# EasyEDA schematic SCH_FB-Collar-Module_2024-04-16.json
TITLE: Sheet_1; REV: 1.0; Date: 2024-04-16; Sheet: 1/1; Drawn By: fcbayernmunchenerlan999; Company: Your Company
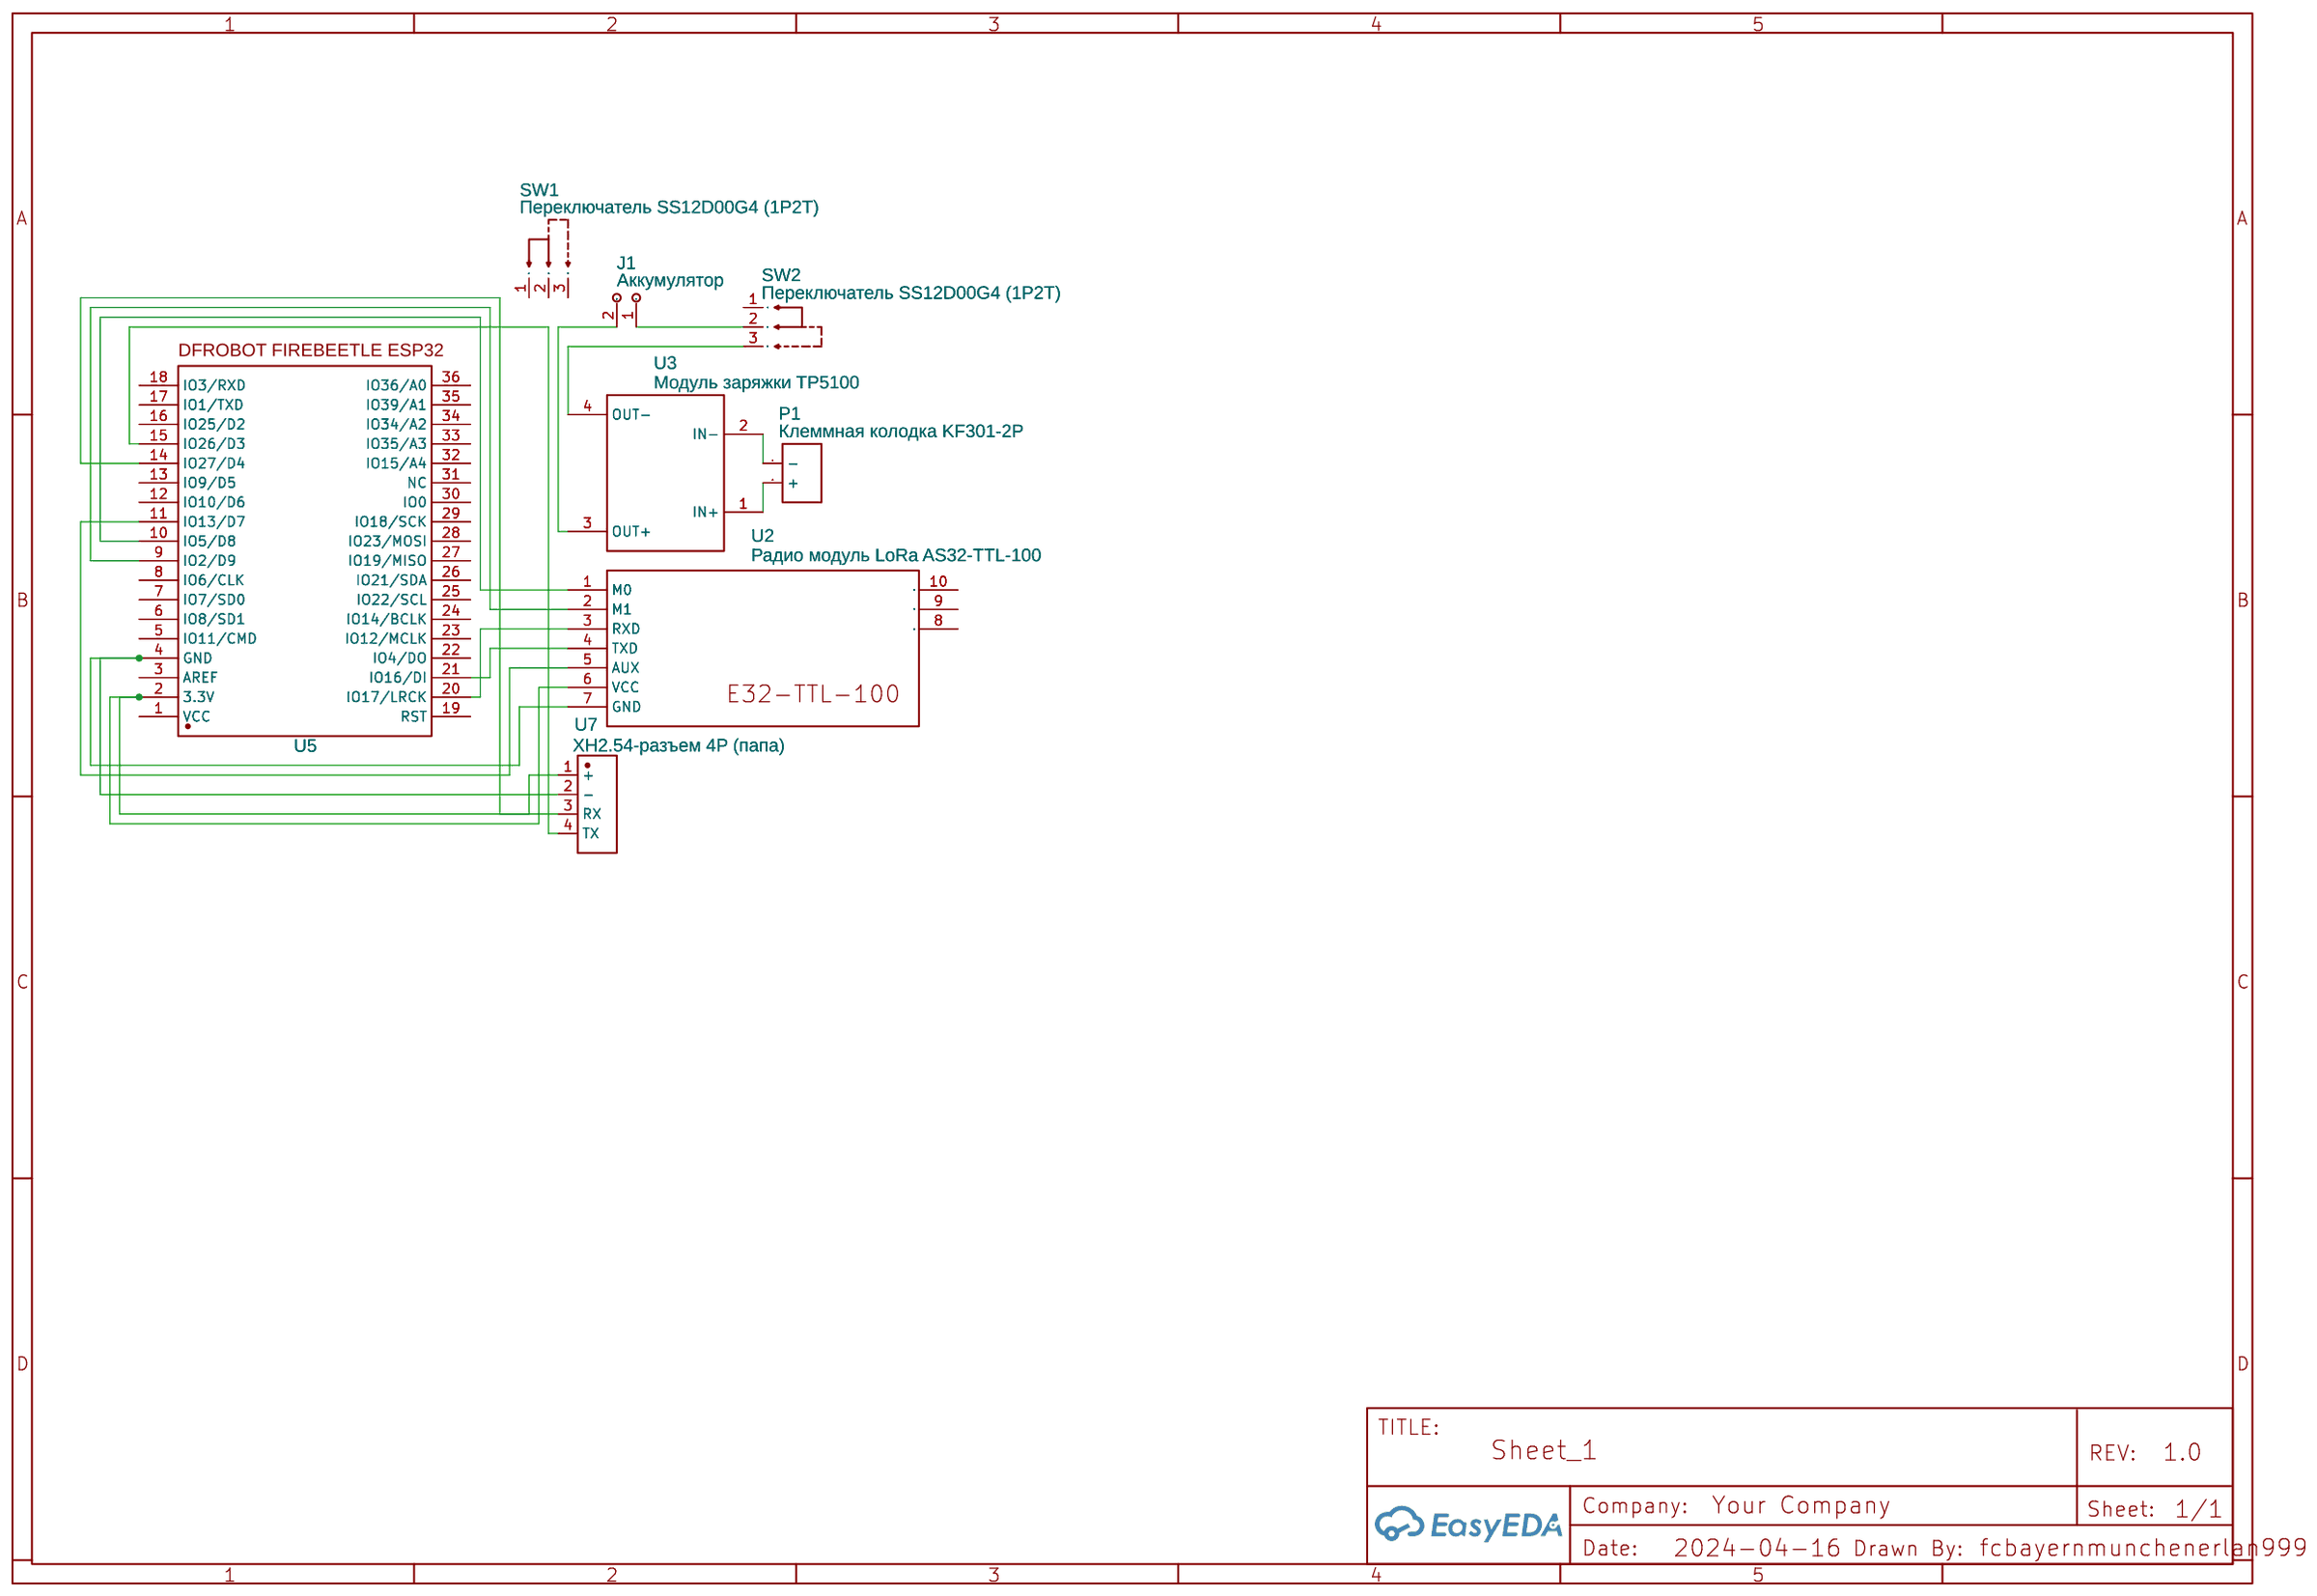
[diagram p0: schematic sheet]

## Parts
J1  Аккумулятор  [2X2.54-HOLE]
P1  Клеммная колодка KF301-2P  [CONN-TH_2P-P5.00]
SW1  Переключатель SS12D00G4 (1P2T)  [SW-TH_G-SWITCH_SS-12E17-G020]
SW2  Переключатель SS12D00G4 (1P2T)  [SW-TH_G-SWITCH_SS-12E17-G020]
U2  Радио модуль LoRa AS32-TTL-100  [WIRELM-TH_E32-433T20DC]
U3  Модуль заряжки TP5100  [TP5100_MODULE_CHARGER]
U5  DFROBOT_FIREBEETLE  [DFROBOT_FIREBEETLE_ESP32]
U7  XH2.54-разъем 4P (папа)  [CONN-TH_4P-P2.50_ZX-XH2.54-4PWZ]

## Library data of the parts
J1 = 2xhole: Contributor: alexey.khozin; Package Display: No
P1 = CONN-TH_2P-P5.00: Supplier: LCSC; Contributor: LCEDA_Lib; Package Display: No
SW1 SW2 = SS-12E17-G020: Contributor: LCSC; Supplier: LCSC; Supplier Part: C2848909; Manufacturer: G-Switch(品赞); JLCPCB Part Class: Extended Part; Package Display: No
U2 = E32-TTL-100: Contributor: LCSC; Supplier: LCSC; Supplier Part: C97350; Manufacturer: EBYTE(亿佰特); Manufacturer Part: E32-433T20DC; JLCPCB Part Class: Extended Part; Package Display: No
U3 = TP5100_MODULE_CHARGER: Contributor: arve050; Package Display: No
U5 = DFROBOT_FIREBEETLE: Contributor: toms56; Package Display: No
U7 = ZX-XH2.54-4PWZ: Contributor: lcsc; Supplier: LCSC; Supplier Part: C7429643; Manufacturer: Megastar(兆星); JLCPCB Part Class: Extended Part; Package Display: No

## Nets
Net-(J1-1): J1.1 SW2.2
Net-(J1-2): J1.2 U3.3(OUT+)
Net-(P1-1): P1.1(-) U3.2(IN-)
Net-(P1-2): P1.2(+) U3.1(IN+)
Net-(SW2-3): SW2.3 U3.4(OUT-)
Net-(U2-1): U2.1(M0) U5.10(IO5/D8)
Net-(U2-2): U2.2(M1) U5.9(IO2/D9)
Net-(U2-3): U2.3(RXD) U5.20(IO17/LRCK)
Net-(U2-4): U2.4(TXD) U5.21(IO16/DI)
Net-(U2-5): U2.5(AUX) U5.11(IO13/D7)
Net-(U2-6): U2.6(VCC) U5.2(3.3V) U7.1(+)
Net-(U2-7): U2.7(GND) U5.4(GND) U7.2(-)
Net-(U5-14): U5.14(IO27/D4) U7.3(RX)
Net-(U5-15): U5.15(IO26/D3) U7.4(TX)

Not connected (* = marked no-connect by the designer): SW1 1 2 3; SW2 1; U2 8 9 10; U5 1(VCC) 3(AREF) 5(IO11/CMD) 6(IO8/SD1) 7(IO7/SD0) 8(IO6/CLK) 12(IO10/D6) 13(IO9/D5) 16(IO25/D2) 17(IO1/TXD) 18(IO3/RXD) 19(RST) 22(IO4/DO) 23(IO12/MCLK) 24(IO14/BCLK) 25(IO22/SCL) 26(IO21/SDA) 27(IO19/MISO) 28(IO23/MOSI) 29(IO18/SCK) 30(IO0) 31(NC) 32(IO15/A4) 33(IO35/A3) 34(IO34/A2) 35(IO39/A1) 36(IO36/A0)
